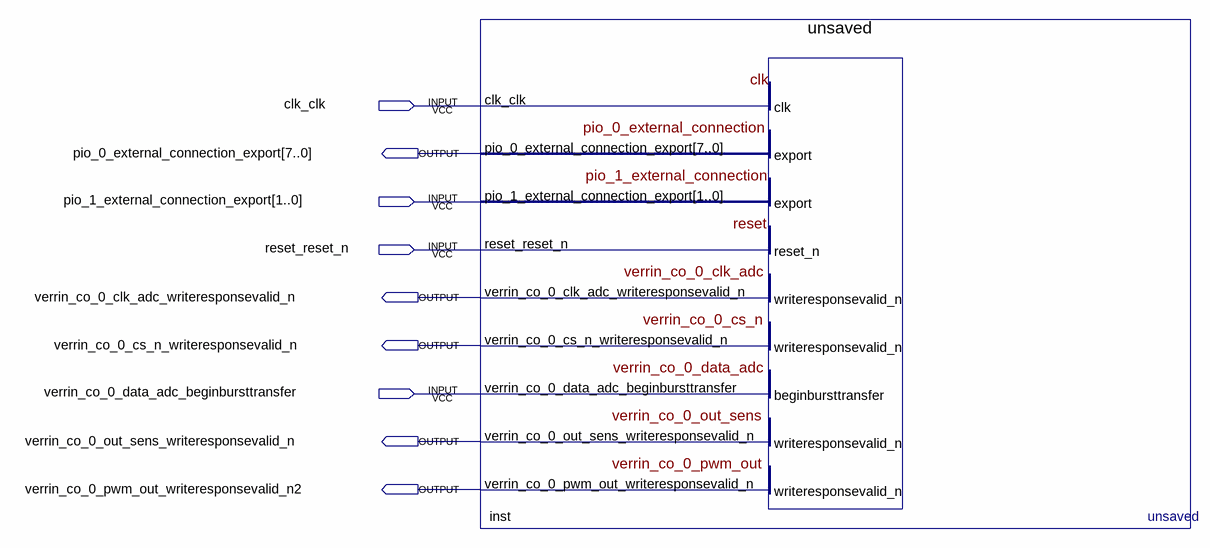
[diagram p0: schematic sheet]
// Quartus schematic test_verr.bdf as structural Verilog: 1 symbols, 9 pins
module test_verr (
  input  clk_clk,
  input  [1:0] pio_1_external_connection_export,
  input  reset_reset_n,
  input  verrin_co_0_data_adc_beginbursttransfer,
  output [7:0] pio_0_external_connection_export,
  output verrin_co_0_clk_adc_writeresponsevalid_n,
  output verrin_co_0_cs_n_writeresponsevalid_n,
  output verrin_co_0_out_sens_writeresponsevalid_n,
  output verrin_co_0_pwm_out_writeresponsevalid_n2
);

  unsaved inst (
    .clk_clk(clk_clk), .pio_1_external_connection_export(pio_1_external_connection_export),
    .reset_reset_n(reset_reset_n),
    .verrin_co_0_data_adc_beginbursttransfer(verrin_co_0_data_adc_beginbursttransfer),
    .pio_0_external_connection_export(pio_0_external_connection_export),
    .verrin_co_0_clk_adc_writeresponsevalid_n(verrin_co_0_clk_adc_writeresponsevalid_n),
    .verrin_co_0_cs_n_writeresponsevalid_n(verrin_co_0_cs_n_writeresponsevalid_n),
    .verrin_co_0_out_sens_writeresponsevalid_n(verrin_co_0_out_sens_writeresponsevalid_n),
    .verrin_co_0_pwm_out_writeresponsevalid_n(verrin_co_0_pwm_out_writeresponsevalid_n2));
endmodule
